# EAGLE design monitoring (EAGLE 7.5.0)
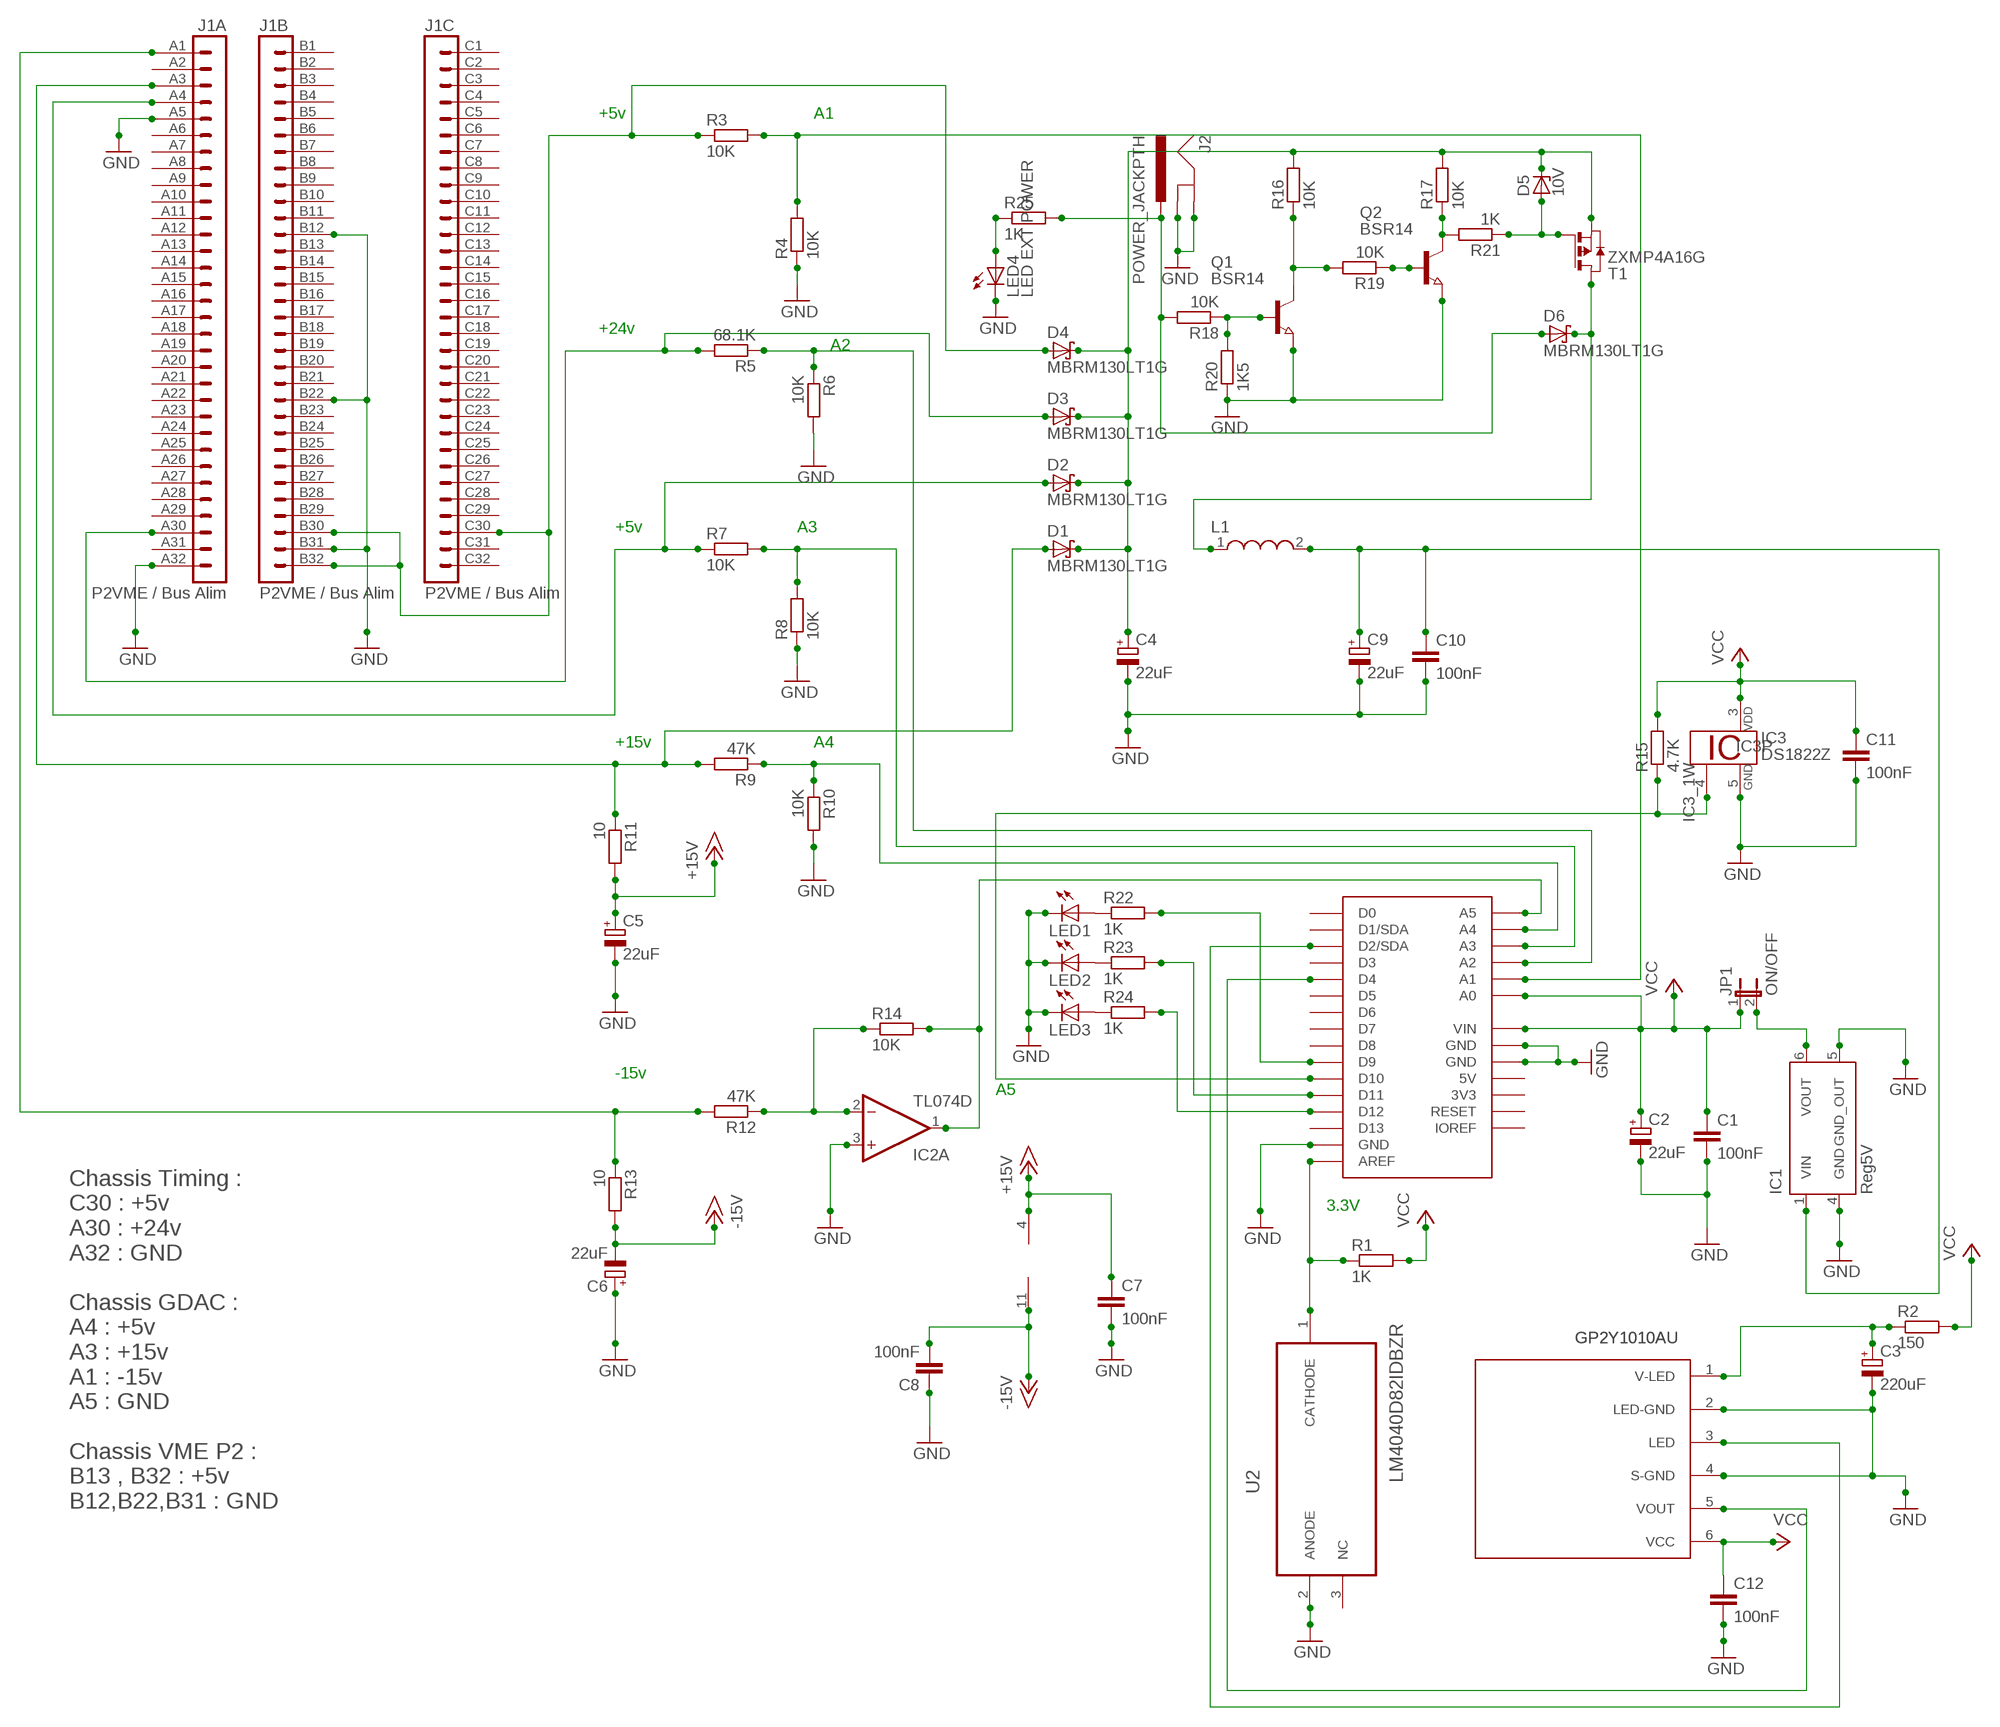
[diagram p0: schematic, sheet 1]

## Parts
C1  100nF  C-EUC1206K  [C1206K]
C2  22uF  CPOL-EUCT7343  [CT7343]
C3  220uF  CPOL-EU150CLZ-0810  [150CLZ-0810]
C4  22uF  CPOL-EUCT7343  [CT7343]
C5  22uF  CPOL-EUCT7343  [CT7343]
C6  22uF  CPOL-EUCT7343  [CT7343]
C7  100nF  C-EUC1206K  [C1206K]
C8  100nF  C-EUC1206K  [C1206K]
C9  22uF  CPOL-EUCT7343  [CT7343]
C10  100nF  C-EUC1206K  [C1206K]
C11  100nF  C-EUC1206K  [C1206K]
C12  100nF  C-EUC1206K  [C1206K]
D1  MBRM130LT1G  SCHOTTKY-DIODE  [DIODE_SMB]
D2  MBRM130LT1G  SCHOTTKY-DIODE  [DIODE_SMB]
D3  MBRM130LT1G  SCHOTTKY-DIODE  [DIODE_SMB]
D4  MBRM130LT1G  SCHOTTKY-DIODE  [DIODE_SMB]
D5  10V  ZENER-DIODESMB  [SMB]
D6  MBRM130LT1G  SCHOTTKY-DIODE  [DIODE_SMB]
IC1  Reg5V  REG5V  [REG5V]
IC2  TL074D  [SO14]
IC3  DS1822Z  [SO08]
J1  P2VME / Bus Alim  VG96-3  [VG96]
J2  POWER_JACKPTH  [POWER_JACK_PTH]
JP1  ON/OFF  JP1E  [JP1]
L1  WE-UKW_1SW_7427501  [WE-UKW_7427501]
LED1  LED_ELD260  [LED_LD260]
LED2  LED_ELD260  [LED_LD260]
LED3  LED_ELD260  [LED_LD260]
LED4  LED EXT POWER  LED_ELD260  [LED_LD260]
Q1  BSR14  NPN-TRANSISTOR_SOT23  [SOT23]
Q2  BSR14  NPN-TRANSISTOR_SOT23  [SOT23]
R1  1K  R-EU_R1206  [R1206]
R2  150  R-EU_R1206  [R1206]
R3  10K  R-EU_R1206  [R1206]
R4  10K  R-EU_R1206  [R1206]
R5  68.1K  R-EU_R1206  [R1206]
R6  10K  R-EU_R1206  [R1206]
R7  10K  R-EU_R1206  [R1206]
R8  10K  R-EU_R1206  [R1206]
R9  47K  R-EU_R1206  [R1206]
R10  10K  R-EU_R1206  [R1206]
R11  10  R-EU_R1206  [R1206]
R12  47K  R-EU_R1206  [R1206]
R13  10  R-EU_R1206  [R1206]
R14  10K  R-EU_R1206  [R1206]
R15  4.7K  R-EU_R1206  [R1206]
R16  10K  R-EU_R1206  [R1206]
R17  10K  R-EU_R1206  [R1206]
R18  10K  R-EU_R1206  [R1206]
R19  10K  R-EU_R1206  [R1206]
R20  1K5  R-EU_R1206  [R1206]
R21  1K  R-EU_R1206  [R1206]
R22  1K  R-EU_R1206  [R1206]
R23  1K  R-EU_R1206  [R1206]
R24  1K  R-EU_R1206  [R1206]
R25  1K  R-EU_R1206  [R1206]
T1  ZXMP4A16G  PMOSSOT223  [SOT223]
U1  YUN_SHIELD-BPLACE  [YUN_SHIELD]
U2  LM4040D82IDBZR  [SOT95P237X112-3N]
U$1  GP2Y1010AU0F  GP2Y1010AU  [GP2Y1010AU]

## Nets
+15V: C5.+ C7.1 IC2.4(P:V+) R11.2
-15V: C6.- C8.2 IC2.11(P:V-) R13.2
GND: C1.2 C2.- C3.- C4.- C5.- C6.+ C7.2 C8.1 C9.- C10.2 C11.2 C12.2 IC1.4(GND) IC1.5(GND_OUT) IC2.3(A:+IN) IC3.5 J1.A5 J1.A32 J1.B12 J1.B22 J1.B31 J2.GND J2.GNDBREAK LED1.K(C) LED2.K(C) LED3.K(C) LED4.K(C) Q1.2(E) Q2.2(E) R4.1 R6.2 R8.1 R10.2 R20.1 U1.GND@1(GND) U1.GND@2(GND) U1.GND@3(GND) U2.2(ANODE) U$1.2(LED-GND) U$1.4(S-GND)
N$1: C3.+ R2.1 U$1.1(V-LED)
N$2: IC1.6(VOUT) JP1.2
N$3: R1.1 U1.AREF U2.1(CATHODE)
N$4: R3.2 R4.2 U1.A1
N$5: R5.1 R6.1 U1.A2
N$6: R7.2 R8.2 U1.A3
N$7: R9.1 R10.1 U1.A4
N$8: Q1.1(B) R18.1 R20.2
N$9: D3.A(C) J1.A30 R5.2
N$10: D2.A(C) J1.A4 R7.1
N$11: D1.A(C) J1.A3 R9.2 R11.1
N$12: C4.+ D1.C(A) D2.C(A) D3.C(A) D4.C(A) D5.C R16.2 R17.2 T1.3(S)
N$13: D4.A(C) J1.B30 J1.B32 J1.C30 R3.1
N$14: IC2.2(A:-IN) R12.1 R14.1
N$15: J1.A1 R12.2 R13.1
N$16: IC2.1(A:OUT) R14.2 U1.A5
N$17: D6.C(A) L1.1 T1.2(D) T1.4(D)
N$18: LED1.A R22.1
N$19: C9.+ C10.1 IC1.1(VIN) L1.2
N$20: Q2.3(C) R17.1 R21.2
N$21: Q2.1(B) R19.1
N$22: Q1.3(C) R16.1 R19.2
N$23: D5.A R21.1 T1.1(G)
N$24: IC3.4 R15.1 U1.D10
N$25: U1.D2(D2/SDA) U$1.3(LED)
N$26: U1.D4 U$1.5(VOUT)
N$27: D6.A(C) J2.PWR R18.2 R25.2
N$28: LED2.A R23.1
N$29: LED3.A R24.1
N$30: R22.2 U1.D9
N$31: LED4.A R25.1
N$32: R23.2 U1.D11
N$33: R24.2 U1.D12
VCC: C1.1 C2.+ C11.1 C12.1 IC3.3 JP1.1 R1.2 R2.2 R15.2 U1.A0 U1.VIN U$1.6(VCC)
Unconnected: IC2.5(B:+IN) IC2.6(B:-IN) IC2.7(B:OUT) IC2.8(C:OUT) IC2.9(C:-IN) IC2.10(C:+IN) IC2.12(D:+IN) IC2.13(D:-IN) IC2.14(D:OUT) J1.A2 J1.A6 J1.A7 J1.A8 J1.A9 J1.A10 J1.A11 J1.A12 J1.A13 J1.A14 J1.A15 J1.A16 J1.A17 J1.A18 J1.A19 J1.A20 J1.A21 J1.A22 J1.A23 J1.A24 J1.A25 J1.A26 J1.A27 J1.A28 J1.A29 J1.A31 J1.B1 J1.B2 J1.B3 J1.B4 J1.B5 J1.B6 J1.B7 J1.B8 J1.B9 J1.B10 J1.B11 J1.B13 J1.B14 J1.B15 J1.B16 J1.B17 J1.B18 J1.B19 J1.B20 J1.B21 J1.B23 J1.B24 J1.B25 J1.B26 J1.B27 J1.B28 J1.B29 J1.C1 J1.C2 J1.C3 J1.C4 J1.C5 J1.C6 J1.C7 J1.C8 J1.C9 J1.C10 J1.C11 J1.C12 J1.C13 J1.C14 J1.C15 J1.C16 J1.C17 J1.C18 J1.C19 J1.C20 J1.C21 J1.C22 J1.C23 J1.C24 J1.C25 J1.C26 J1.C27 J1.C28 J1.C29 J1.C31 J1.C32 U1.D0 U1.D1(D1/SDA) U1.D3 U1.D5 U1.D6 U1.D7 U1.D8 U1.D13 U1.RESET U2.3(NC)

## Notes on the sheet
- +5v | A1
- +24v
- A2
- +5v | A3
- +15v | A4
- -15v
- A5
- 3.3V
- GP2Y1010AU | GP2Y1010AU
- Chassis Timing :
  C30 : +5v 
  A30 : +24v
  A32 : GND
  
  Chassis GDAC :
  A4 : +5v
  A3 : +15v
  A1 : -15v
  A5 : GND
  
  Chassis VME P2 :
  B13 , B32 : +5v
  B12,B22,B31 : GND

## Power pins joined to a net without a drawn wire
3V3: U1.3V3
5V: U1.5V
IOREF: U1.IOREF

## Library data of the parts
C1 C7 C8 C10-C12 = resistor:C-EU: CAPACITOR, European symbol
C2-C6 C9 = resistor:CPOL-EU: POLARIZED CAPACITOR, European symbol
D1-D4 D6 = eagle-ltspice:SCHOTTKY-DIODE: Schottky Diode; SPICEMODEL: NONE; SPICEPREFIX: D; SPICETYPE: diode
D5 = diode:ZENER-DIODE: Z-Diode
IC1 = Reg5v:REG5V: Constant Output SEPIC Converter 5V 1A Source: https://github.com/esaid/Sepic_converter; REG5V: 5V
IC2 = linear:TL074: OP AMP
IC3 = 1wire:DS1822: Econo Digital Thermometer This chip provides a onewire thermosensor with approx. 2°C accuracy. A programmable over/undertemperure alarm is available. Notes: Vdd must be applied for accurate measurements at low temperatures, as the parasite power circuit otherwise heats the sensor. If parasite power is used, Vdd has to be connected to GND. The DS18B20 and DS18S20 are similar chips with approx. 0.5°C accuracy. Author: Jan Kandziora <jjj@gmx.de>
J1 = 19inch:VG96-3: PCB EUROCARD, 96-pin type C/ABC, 2.54 mm
J2 = SparkFun-Connectors:POWER_JACK: Power Jack This is the standard 5.5mm barrel jack for power. The PTH is the most common, proven, reliable, footprint. The Slot footprint only works if the mill layer is transmitted to the PCB fab house so be warned. Mating wall wart : TOL-00298 (and others); PROD_ID: CONN-08197
JP1 = jumper:JP1E: JUMPER
L1 = Eagle_POWER_MAGNETICS_rev16c:WE-UKW_1SW: WE-UKW EMI Suppression 6-Hole Ferrite Bead Characteristics Impedance will increase with more turns, available in 1 to 3 turns 4 different materials available for perfect interference suppression Also available ready-bent or in individual length Maximum current capability is 3 A / 5 A (short-time) Operating temperature: –25 ºC to +125 ºC Applications Protection against radio frequency interferences of components on PCB’s of PC’s, text processing and other digital devices <http://katalog.we-online.de/media/images/eisos/FeUKW_pf2.jpg> Details see: http://katalog.we-online.de/en/pbs/WE-UKW/S/ Created by Dan Xu 2014-06-10 2014 (C) Wurth Elektronik
LED1-LED4 = eagle-ltspice:LED_E: LED Source: http://www.osram.convergy.de Source: www.luxeon.com Source: www.kingbright.com; SPICEMODEL: NONE; SPICEPREFIX: D; SPICETYPE: diode
Q1 Q2 = semicon-smd-ipc:NPN-TRANSISTOR_: NPN TRANSISTOR
R1-R25 = resistor:R-EU_: RESISTOR, European symbol
T1 = zetex:PMOSSOT223: MOS FET; OC_FARNELL: unknown; OC_NEWARK: unknown
U1 = yun_shield:YUN_SHIELD: Arduino YUN mini shield. Originally taken from Adafruit's UNO R3 shield.
U2 = Texas Instruments_By_element14_Batch_1:LM4040D82IDBZR: PRECISION MICROPOWER SHUNT VOLTAGE REFERENCE; MPN: LM4040D82IDBZR; OC_FARNELL: 1576237; OC_NEWARK: 84K2958; PACKAGE: 3-SOT-23; SUPPLIER: TEXAS INSTRUMENTS
U$1 = gp2y1010au:GP2Y1010AU: GP2Y1010AU0F is a dust sensor by optical sensing system. An infrared emitting diode (IRED) and an phototransistor are diagonally arranged into this device. It detects the reflected light of dust in air. Especially, it is effective to detect very fine particle like the cigarette smoke. In addition it can distinguish smoke from house dust by pulse pattern of output voltage. 1. Compact, thin package (46.0 × 30.0 × 17.6 mm) 2. Low consumption current (Icc: MAX. 20 mA) 3. The presence of dust can be detected by the photometry of only one pulse

## Net classes
0 default: width 0.61 mm, clearance 0.205 mm

## Board
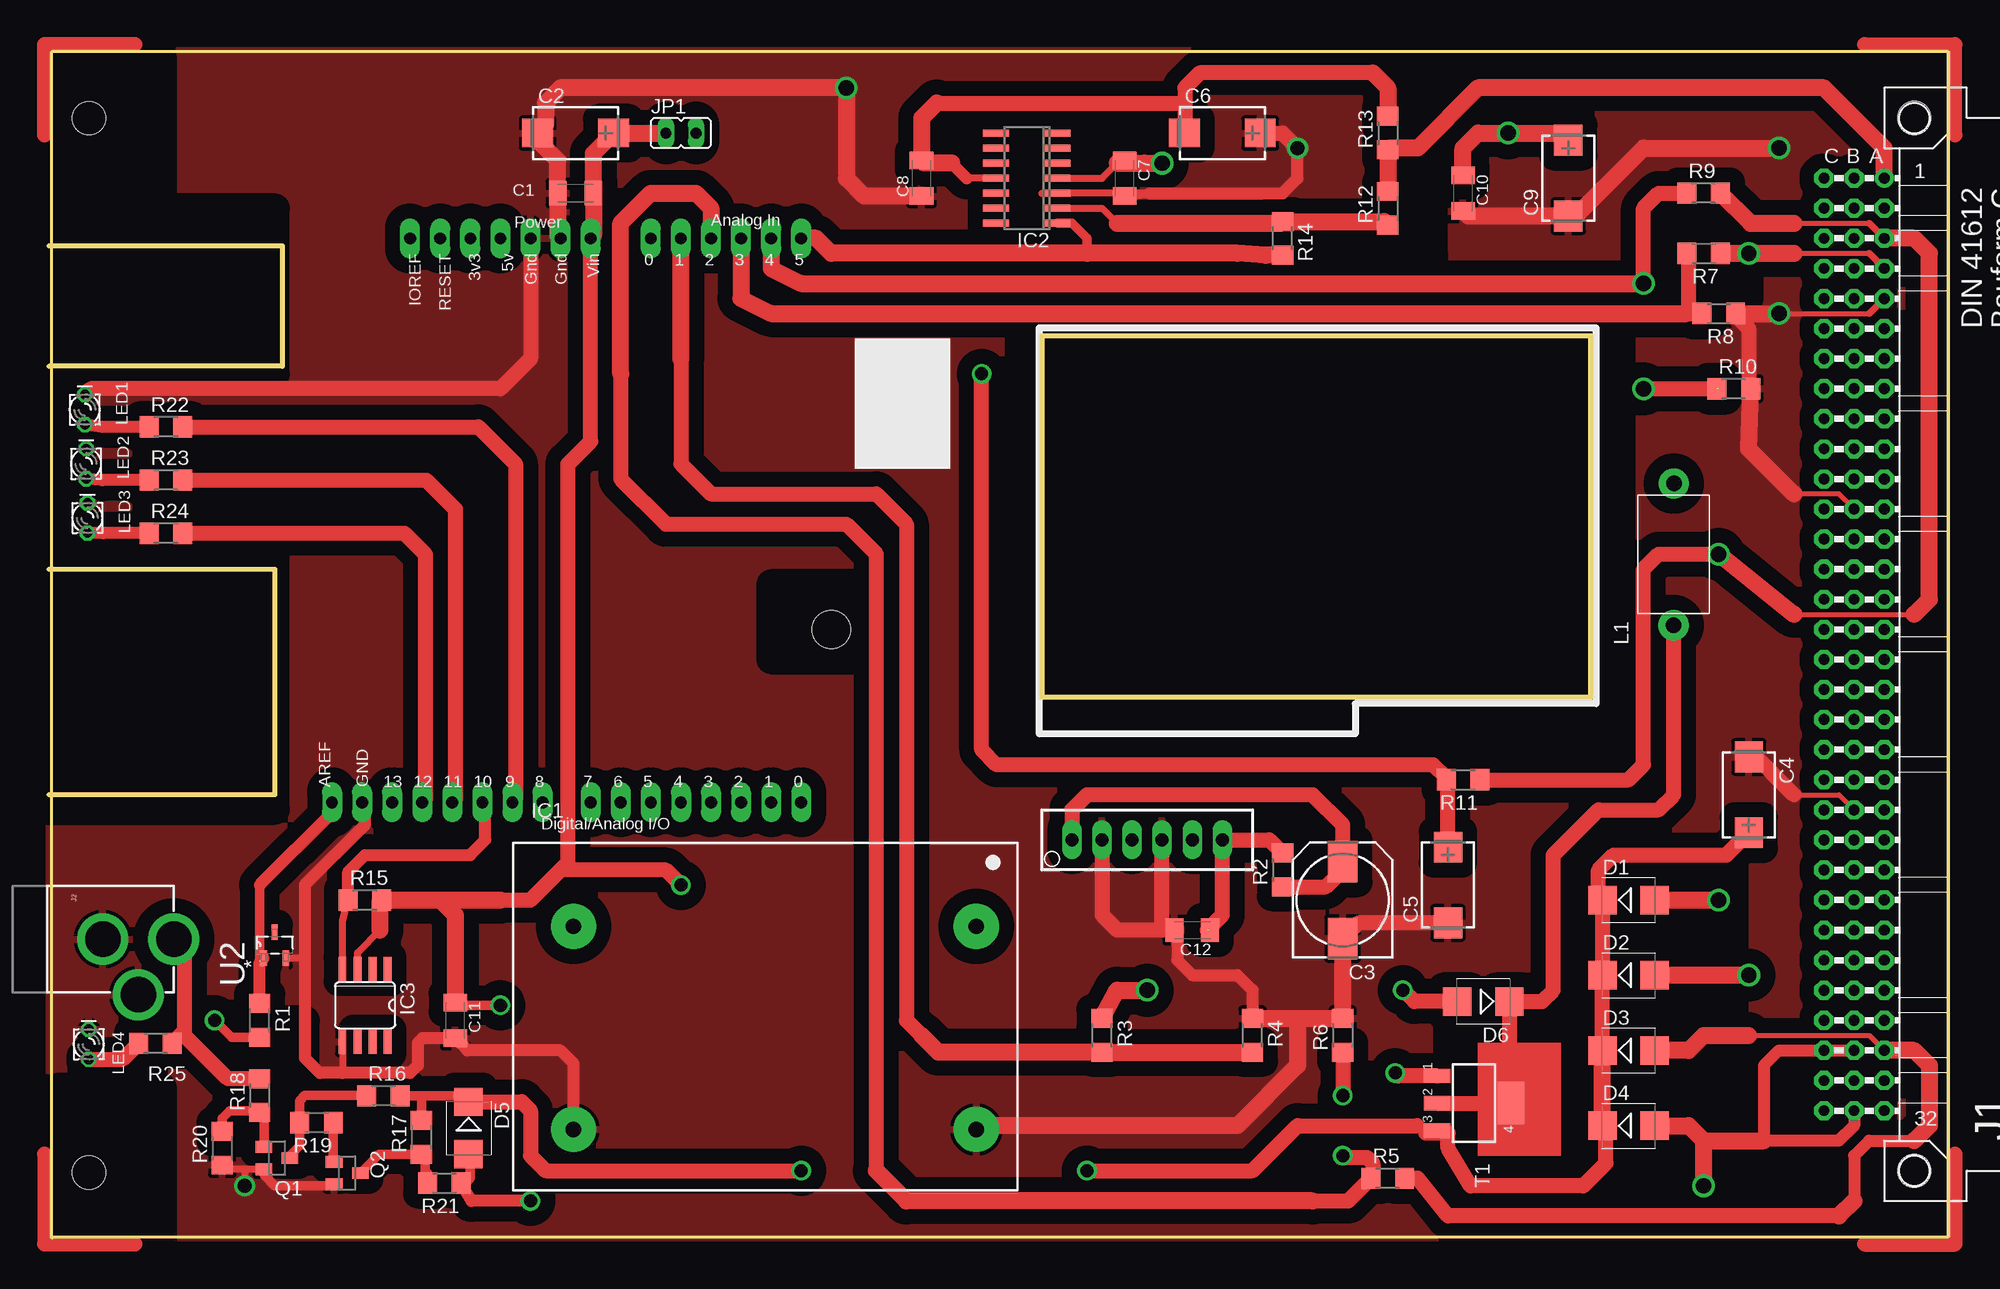
[diagram p1: board, top side]
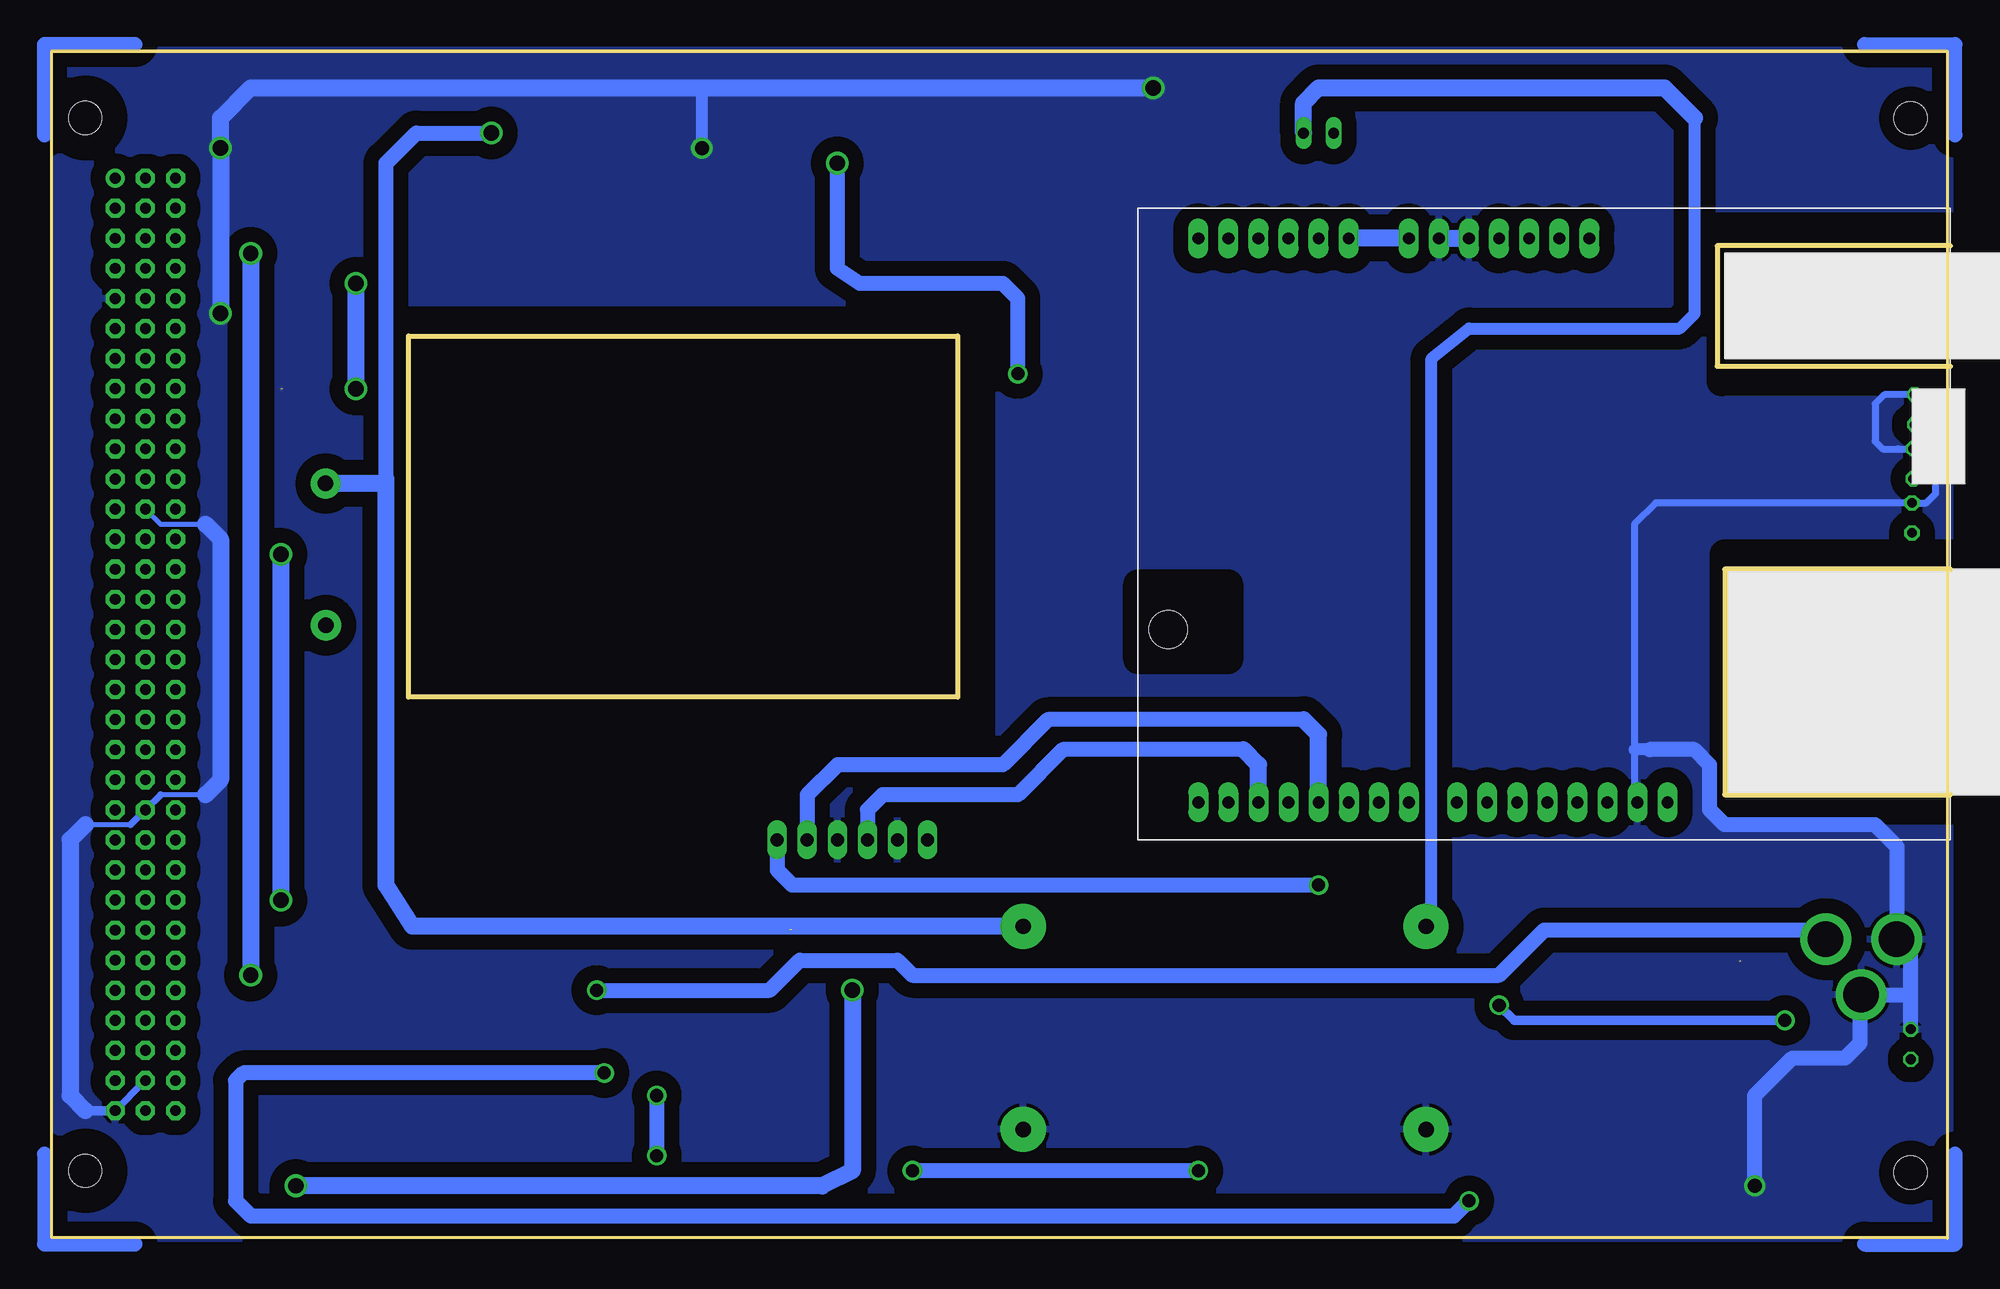
[diagram p2: board, bottom side, seen from below]

Size 160.02 x 100.03 mm. Coordinates in mm from the lower left corner, seen from the top.
Copper layers (1*2+3*4+5*6+7*16): Top 0.035mm / dielectric 0.2mm / Route2 0.035mm / dielectric 0.15mm / Route3 0.035mm / dielectric 0.2mm / Route4 0.035mm / dielectric 0.15mm / Route5 0.035mm / dielectric 0.2mm / Route6 0.035mm / dielectric 0.15mm / Route7 0.035mm / dielectric 0.2mm / Bottom 0.035mm
Design rules "Eagle_WEdirekt_150_check *": minimum track width 6mil, minimum drill 0.25mm, track to track 6mil, track to pad 8mil, pad to pad 8mil, via to via 6mil, smd to smd 8mil, copper to edge 0mil, drill to drill 24mil, minimum pad ring 9mil, minimum via ring 9mil, stop-mask expansion 3mil, vias tented up to drill 0mil, thermal gap 12mil
Holes 2.8 mm at 3.1,94.45 3.1,5.42
tRestrict: area -7.9,72.9 to 18.8,86.8; area -9.1,36 to 18.8,57.6; area 60.7,48.7 to 68.3,55.1; area 117.9,11.9 to 121.7,18.3; area 133.1,13.2 to 142,31; area 105.2,81.8 to 115.3,84.3; area 139.4,79.2 to 143.3,81.8; area 18.8,13.2 to 21.3,18.3; area -0.3,57.6 to 1,72.9; area 112.8,83 to 116.6,89.4; area 81.7,41.1 to 132.5,76.7; area 0.4,-0.2 to 9.3,12.5; area 0.4,86.8 to 9.3,99.5
bRestrict: area -7.9,72.2 to 19.1,85.2; area -9.1,36 to 18.8,57.6; area 60.7,48.7 to 68.3,55.1; area 81.7,41.1 to 130.6,77.3
Milling: 16 lines

### Footprints (pad centres in the part's own frame; a part is rotated, then mirrored left to right if it is on the bottom)
C1206K = smd 1.5 x 2: 1 -1.5,0; 2 1.5,0
CT7343 = smd 2.6 x 2.4: + 3.2,0; - -3.2,0
150CLZ-0810 = smd 3.5 x 2.5: + 3.25,0; - -3.25,0
DIODE_SMB = smd 2.4 x 2.4: A 2.2,0; C -2.2,0
SMB = smd 2.4 x 2.4: A 2.2,0; C -2.2,0
REG5V = drill 1.3 pad 3.81: 1 27.483,6.668; 4 27.483,-10.477; 5 -6.527,-10.477; 6 -6.527,6.668
SO14 = smd 0.6 x 2.2: 1 -3.81,-2.6; 2 -2.54,-2.6; 3 -1.27,-2.6; 4 0,-2.6; 5 1.27,-2.6; 6 2.54,-2.6; 7 3.81,-2.6; 8 3.81,2.6; 9 2.54,2.6; 10 1.27,2.6; 11 0,2.6; 12 -1.27,2.6; 13 -2.54,2.6; 14 -3.81,2.6
SO08 = smd 0.66 x 2.032: 1 -1.905,-3.073; 2 -0.635,-3.073; 3 0.635,-3.073; 4 1.905,-3.073; 5 1.905,3.073; 6 0.635,3.073; 7 -0.635,3.073; 8 -1.905,3.073
VG96 = drill 0.914 pad 1.6: A1 154.94,39.37 | drill 0.914 pad 1.6 octagon: A2 154.94,36.83; A3 154.94,34.29; A4 154.94,31.75; A5 154.94,29.21; A6 154.94,26.67; A7 154.94,24.13; A8 154.94,21.59; A9 154.94,19.05; A10 154.94,16.51; A11 154.94,13.97; A12 154.94,11.43; A13 154.94,8.89; A14 154.94,6.35; A15 154.94,3.81; A16 154.94,1.27; A17 154.94,-1.27; A18 154.94,-3.81; A19 154.94,-6.35; A20 154.94,-8.89; A21 154.94,-11.43; A22 154.94,-13.97; A23 154.94,-16.51; A24 154.94,-19.05; A25 154.94,-21.59; A26 154.94,-24.13; A27 154.94,-26.67; A28 154.94,-29.21; A29 154.94,-31.75; A30 154.94,-34.29; A31 154.94,-36.83; A32 154.94,-39.37; B1 152.4,39.37; B2 152.4,36.83; B3 152.4,34.29; B4 152.4,31.75; B5 152.4,29.21; B6 152.4,26.67; B7 152.4,24.13; B8 152.4,21.59; B9 152.4,19.05; B10 152.4,16.51; B11 152.4,13.97; B12 152.4,11.43; B13 152.4,8.89; B14 152.4,6.35; B15 152.4,3.81; B16 152.4,1.27; B17 152.4,-1.27; B18 152.4,-3.81; B19 152.4,-6.35; B20 152.4,-8.89; B21 152.4,-11.43; B22 152.4,-13.97; B23 152.4,-16.51; B24 152.4,-19.05; B25 152.4,-21.59; B26 152.4,-24.13; B27 152.4,-26.67; B28 152.4,-29.21; B29 152.4,-31.75; B30 152.4,-34.29; B31 152.4,-36.83; B32 152.4,-39.37; C1 149.86,39.37; C2 149.86,36.83; C3 149.86,34.29; C4 149.86,31.75; C5 149.86,29.21; C6 149.86,26.67; C7 149.86,24.13; C8 149.86,21.59; C9 149.86,19.05; C10 149.86,16.51; C11 149.86,13.97; C12 149.86,11.43; C13 149.86,8.89; C14 149.86,6.35; C15 149.86,3.81; C16 149.86,1.27; C17 149.86,-1.27; C18 149.86,-3.81; C19 149.86,-6.35; C20 149.86,-8.89; C21 149.86,-11.43; C22 149.86,-13.97; C23 149.86,-16.51; C24 149.86,-19.05; C25 149.86,-21.59; C26 149.86,-24.13; C27 149.86,-26.67; C28 149.86,-29.21; C29 149.86,-31.75; C30 149.86,-34.29; C31 149.86,-36.83; C32 149.86,-39.37 | hole 2.794: 157.48,44.45; 157.48,-44.45
POWER_JACK_PTH = drill 2.997 pad 4.318: GND 0,7.7; GNDBREAK 4.7,10.7; PWR 0,13.7
JP1 = drill 0.914 long: 1 0,-1.27; 2 0,1.27
WE-UKW_7427501 = drill 0.8: 1 -6,0; 2 6,0
LED_LD260 = drill 0.813 octagon: A -1.27,0; K 1.27,0
SOT23 = smd 1 x 1.4: 1 -0.95,-1.1; 2 0.95,-1.1; 3 0,1.1
R1206 = smd 1.6 x 1.803: 1 -1.422,0; 2 1.422,0
SOT223 = smd 1.219 x 2.235: 1 -2.311,-3.099; 2 0,-3.099; 3 2.311,-3.099 | smd 3.6 x 2.2: 4 0,3.099
YUN_SHIELD = drill 1 pad 1.676 long: 3V3 -43.18,2.54; 5V -45.72,2.54; A0 -58.42,2.54; A1 -60.96,2.54; A2 -63.5,2.54; A3 -66.04,2.54; A4 -68.58,2.54; A5 -71.12,2.54; AREF -31.496,50.165; D0 -71.12,50.165; D1 -68.58,50.165; D2 -66.04,50.165; D3 -63.5,50.165; D4 -60.96,50.165; D5 -58.42,50.165; D6 -55.88,50.165; D7 -53.34,50.165; D8 -49.276,50.165; D9 -46.736,50.165; D10 -44.196,50.165; D11 -41.656,50.165; D12 -39.116,50.165; D13 -36.576,50.165; GND@1 -50.8,2.54; GND@2 -48.26,2.54; GND@3 -34.036,50.165; IOREF -38.1,2.54; RESET -40.64,2.54; VIN -53.34,2.54 | hole 3.2: -73.66,35.56
SOT95P237X112-3N = smd 1.321 x 0.559: 1 -1.092,0.94; 2 -1.092,-0.94 | smd 1.321 x 0.508: 3 1.092,0
GP2Y1010AU = drill 1.1 long: 1 -27.94,5.08; 2 -25.4,5.08; 3 -22.86,5.08; 4 -20.32,5.08; 5 -17.78,5.08; 6 -15.24,5.08

### Placement (x,y rotation side)
C1  44.2,88.11 180 top
C2  44.2,93.19 0 top
C3  108.97,28.42 90 top
C4  143.26,37.31 270 top
C5  117.86,29.69 90 top
C6  98.81,93.19 0 top
C7  90.55,89.38 270 top
C8  73.41,89.38 90 top
C9  128.02,89.38 90 top
C10  119.13,88.11 270 top
C11  34.04,18.26 270 top
C12  96.27,25.88 180 top
D1  133.1,28.42 0 top
D2  133.1,22.07 0 top
D3  133.1,15.72 0 top
D4  133.1,9.37 0 top
D5  35.16,9.18 270 top
D6  120.84,19.85 180 top
IC1  50.55,19.53 0 top
IC2  82.3,89.38 90 top
IC3  26.42,19.53 180 top
J1  -0.25,50.01 0 top
J2  -3.43,25.12 270 top
JP1  53.09,93.19 270 top
L1  136.91,57.63 90 top
LED1  2.76,69.84 90 top
LED2  2.87,65.27 90 top
LED3  2.98,60.69 90 top
LED4  3.09,16.24 90 top
Q1  18.98,6.64 270 top
Q2  24.91,5.37 270 top
R1  17.53,18.26 270 top
R2  103.89,30.96 90 top
R3  88.65,16.99 270 top
R4  101.35,16.99 270 top
R5  112.78,4.93 0 top
R6  108.97,16.99 90 top
R7  139.45,83.03 180 top
R8  140.72,77.95 180 top
R9  139.45,88.11 0 top
R10  141.99,71.6 0 top
R11  119.13,38.58 180 top
R12  112.78,86.84 90 top
R13  112.78,93.19 90 top
R14  103.89,84.3 270 top
R15  26.42,28.42 0 top
R16  27.97,11.89 0 top
R17  31.18,8.38 90 top
R18  17.53,11.91 90 top
R19  22.32,9.65 180 top
R20  14.35,7.47 90 top
R21  33.12,4.52 180 top
R22  9.61,68.38 0 top
R23  9.61,63.89 0 top
R24  9.61,59.4 0 top
R25  8.72,16.32 0 top
T1  120.05,11.27 270 top
U1  -7.87,86.84 180 top
U2  18.8,24.61 90 top
U$1  114.05,28.42 0 top

### Tracks (layer width: path | path; a pad name or v marks a point on that pad's centre or on a via)
+15V  (via drill 1.1, 1.3 pad 1.78)
  Top 0.61: IC2.4 88.65,89.38 89.92,90.65 | 92.23,90.65 C7.1
  Top 1.27: C5.+ 117.86,38.43 R11.2 117.7,38.73 116.59,39.85 79.76,39.85 78.49,41.12 v78.49,72.87
  Top 1.422: 89.92,90.65 92.23,90.65 v93.73,90.65
  Bottom 1.27: v78.49,72.87 78.49,79.22 79.76,80.49 91.82,80.49 93.73,81.76 v93.73,90.65
-15V
  Top 0.61: IC2.11 77.22,89.38 | 73.64,90.65 C8.2
  Top 1.016: 77.22,89.38 75.95,90.65
  Top 1.27: 74.68,95.73 95.63,95.73 | 111.51,98.27 96.9,98.27 95.63,97 95.63,95.73 | 95.63,95.73 95.63,93.22 C6.-
  Top 1.422: 75.95,90.65 73.64,90.65 | 74.68,95.73 73.41,94.46 C8.2 | 111.51,98.27 112.78,97 R13.2
GND  (via drill 1.2, 1.3 pad 1.78)
  Top 0.406: J1.B12 150.88,62.71 147.07,62.71 | J1.B22 150.88,37.31 147.07,37.31 | v145.8,77.95 153.42,77.95
  Top 0.61: C7.2 92.23,88.11 IC2.3 83.57,88.11 | 119.56,86.18 C10.2 | 40.39,93.19 C2.- | 42.7,84.53 U1.GND@1 | 34.27,16.99 C11.2 | 153.42,77.95 J1.A5 | IC3.5 24.51,13.82 | U2.2 21.16,23.52 21.34,23.34 | R20.1 14.71,5.69 Q1.2 16.26,5.69 v16.26,4.29
  Top 0.813: 108.81,18.26 R6.2 | 105,18.41 105.16,18.26 | 41.66,93.85 C2.- | 92.69,88.11 C7.2 | C9.- 128.63,86.18 | Q1.2 17.88,5.21 18.8,4.29 23.69,4.29 Q2.2
  Top 1.016: IC1.5 44.02,14.63 42.93,15.72 35.08,15.72 C11.2 31.27,16.76 30.86,16.36 30.86,14.45 30.23,13.82 24.51,13.82 22.61,13.82 21.34,15.09 21.34,23.34 21.34,29.69 26.42,34.77 26.42,36.42 U1.GND@3 | C12.2 95,25.88 95,23.34 96.27,22.07 100.08,22.07 101.35,20.8 R4.1 | 93.73,32.23 U$1.4 | 92.69,88.11 103.89,88.11 105.16,89.38 v105.16,91.92
  Top 1.27: C5.- 110.29,26.49 C3.- | R8.1 142.14,77.8 143.26,76.68 143.26,71.75 R10.2 | 147.07,37.31 143.26,41.12 | U$1.2 88.65,27.15 89.92,25.88 93.73,25.88 93.73,32.23 | U1.GND@2 40.39,74.14 37.85,71.6 3.26,71.6 LED1.K | C6.+ 103.89,93.19 v105.16,91.92
  Top 1.422: 147.07,62.71 143.26,66.52 R10.2 | C9.- 119.56,86.18 | 40.39,93.19 42.7,90.88 C1.2 42.7,84.53 | C3.- R6.2 R4.1 105,18.41 | 105.16,18.26 105.16,14.45 100.08,9.37 78.35,9.37 IC1.4 | C8.1 68.56,87.88 67.06,89.38 v67.06,97 42.93,97 41.66,95.73 41.66,93.85 | 128.63,86.18 134.37,91.92 v145.8,91.92 | R8.1 v145.8,77.95
  Bottom 0.406: J1.B12 150.88,60.17 147.07,60.17 | 153.42,34.77 157.23,34.77 | 147.07,37.31 150.88,37.31
  Bottom 0.61: J1.A32 J1.B31 | 153.42,34.77 J1.B22 150.88,37.31 | LED2.K 4.13,66.52 1.02,66.52 | 1.02,66.52 1.02,70.33 1.79,71.11 LED1.K 5.32,71.11 6.1,70.33 6.1,67.16 5.46,66.52 4.19,66.52 | 1.02,66.52 1.02,62.71 1.77,61.96 LED3.K 24.62,61.96 26.42,60.17 26.42,41.12 26.42,36.93 U1.GND@3
  Bottom 0.813: 157.23,10.64 J1.A32
  Bottom 1.016: v105.16,91.92 105.16,97 | 25.15,41.12 26.42,41.12 | 4.26,24.96 J2.GND
  Bottom 1.27: 25.15,41.12 21.34,41.12 20.07,39.85 20.07,36.04 18.8,34.77 6.1,34.77 4.26,32.94 4.26,24.96 | LED4.K 3.09,20.17 | 3.09,20.17 3.09,23.94 J2.GND | 3.09,20.17 3.35,20.42 J2.GNDBREAK 7.37,20.33 7.37,16.36 8.64,15.09 13.08,15.09 16.26,11.91 v16.26,4.29
  Bottom 1.422: U1.GND@1 U1.GND@2 | 147.07,60.17 145.8,58.9 145.8,38.58 147.07,37.31 | 157.23,34.77 158.5,33.5 158.5,11.91 157.23,10.64 | v67.06,97 105.16,97 143.26,97 145.8,94.46 v145.8,91.92 v145.8,77.95
  pour Bottom (isolate 1.27): -0.25,100.18 159.77,100.18 159.77,-0.15 -0.25,-0.15
  pour Top (isolate 1.27): -0.25,100.18 160.4,100.18 160.4,-0.15 -0.25,-0.15
N$1
  Top 1.27: R2.1 107.54,29.54 108.97,30.96 C3.+ 108.97,34.77 106.43,37.31 87.38,37.31 86.11,36.04 U$1.1
N$2
  Bottom 1.016: IC1.6 43.88,26.2 43.56,27.15 43.56,74.14 40.39,76.68 22.61,76.68 21.34,77.95 21.34,94.46
  Bottom 1.422: JP1.2 54.36,95.73 53.09,97 23.88,97 21.34,94.46
N$3  (1 unrouted)
  Top 0.813: 17.53,29.69 17.53,23.34
  Top 1.016: R1.1 17.53,23.19 U2.1 | U1.AREF 23.62,35.79 17.53,29.69
N$4
  Top 1.27: 53.09,74.14 53.09,65.25 55.63,62.71 69.6,62.71 72.14,60.17 72.14,18.26 74.04,16.36
  Top 1.422: R4.2 R3.2 74.83,15.57 74.04,16.36 73.41,16.99 | 53.09,74.14 U1.A1
N$5  (via drill 1.1)
  Top 1.27: v108.97,6.83 108.81,6.68 111.02,6.68 111.51,6.2 111.51,5.08 R5.1 109.45,3.02 106.43,3.02 | R6.1 v108.97,11.91 | 69.6,5.56 69.6,57.63 67.06,60.17 51.82,60.17 48.01,63.98 48.01,72.87
  Top 1.422: 106.43,3.02 72.14,3.02 69.6,5.56 | 48.01,72.87 48.01,85.57 50.55,88.11 54.36,88.11 55.63,86.84 U1.A2
  Bottom 1.27: v108.97,11.91 v108.97,6.83
N$6
  Top 1.27: 138.02,77.95 138.18,77.95 | 138.18,77.95 138.18,82.88 R7.2 | 138.18,77.95 R8.2
  Top 1.422: U1.A3 58.17,79.22 60.71,77.95 138.02,77.95
N$7  (via drill 1.3 pad 1.78)  (1 unrouted)
  Top 1.27: v134.37,80.49 134.37,86.84 135.64,88.11 R9.1 | v134.37,71.6 140.72,71.6
  Top 1.422: U1.A4 60.71,81.76 63.25,80.49 v134.37,80.49
  Bottom 1.422: v134.37,71.6 v134.37,80.49
N$8
  Top 0.813: R20.2 14.35,10.01 14.99,10.64 17.37,10.64 R18.1 17.88,10.13 Q1.1
N$9
  Top 0.406: J1.A30 153.42,16.99 143.26,16.99
  Top 1.016: 157.23,8.1 153.42,8.1 152.15,6.83 152.15,3.02
  Top 1.27: 150.88,1.75 117.86,1.75 115.32,4.93 R5.2
  Top 1.422: D3.A 138.18,15.72 139.45,16.99 143.26,16.99 | J1.A30 157.23,15.72 158.5,14.45 158.5,9.37 157.23,8.1 | 152.15,3.02 150.88,1.75
N$10  (via drill 1.3 pad 1.78)
  Top 0.406: 147.07,83.03 153.42,83.03
  Top 0.61: J1.A4 153.42,83.03
  Top 1.422: R7.1 v143.26,83.03 147.07,83.03 | v143.26,22.07 D2.A
  Bottom 1.422: v143.26,83.03 v143.26,22.07
N$11  (via drill 1.3 pad 1.78)
  Top 0.406: 147.07,85.57 153.42,85.57 | 147.07,52.55 157.23,52.55
  Top 0.61: J1.A3 153.42,85.57
  Top 1.27: R11.1 133.1,38.58 134.37,39.85 134.37,56.36 135.64,57.63 v140.72,57.63
  Top 1.422: R9.2 143.41,85.57 147.07,85.57 | 157.23,52.55 158.5,53.82 158.5,83.03 157.23,84.3 J1.A3 | D1.A v140.72,28.42 | v140.72,57.63 147.07,52.55
  Bottom 1.422: v140.72,57.63 v140.72,28.42
N$12  (via drill 1.1)
  Top 0.61: 115.26,9.37 T1.3
  Top 0.813: R16.2 31.5,11.89 | 31.5,11.89 35.92,11.89 D5.C | R17.2 31.18,11.57 31.5,11.89 | 115.26,9.37 115.32,9.37 115.95,8.74
  Top 1.27: D5.C 39.64,11.38 40.39,10.64 40.39,6.83 41.66,5.56 v63.25,5.56 | v87.38,5.56 101.35,5.56 105.16,9.37 115.26,9.37 | D3.C D2.C D1.C 130.56,28.76 130.56,30.96 131.83,32.23 141.38,32.23 C4.+ | 115.95,8.74 117.86,8.74 117.86,7.47 119.76,4.29 129.29,4.29 131.19,6.2 131.19,9.08 D4.C
  Top 1.422: D4.C D3.C
  Bottom 1.27: v63.25,5.56 v87.38,5.56
N$13  (via drill 1.3 pad 1.78)
  Top 1.016: J1.B32 152.15,9.37 150.88,8.1 144.53,8.1 144.53,14.45 145.8,15.72 J1.C30 J1.B30
  Top 1.422: R3.1 89.92,20.8 v92.46,20.8 | D4.A 138.18,9.37 139.45,8.1 | 139.45,8.1 144.53,8.1 | v139.45,4.29 139.45,8.1
  Bottom 1.422: v92.46,20.8 92.46,5.56 95,4.29 v139.45,4.29
N$14
  Top 0.61: IC2.2 88.65,86.84 89.92,85.57 | 103.73,85.57 R14.1
  Top 0.813: 112.47,85.72 R12.1
  Top 1.422: R14.1 112.47,85.72 | 89.92,85.57 103.73,85.57
N$15
  Top 0.813: 112.93,91.92 R13.1
  Top 1.422: J1.A1 154.69,91.92 149.61,97 120.4,97 115.32,91.92 112.93,91.92 | R13.1 R12.2
N$16
  Top 0.813: IC2.1 86.11,85.57 87.38,84.3 87.38,83.03
  Top 1.422: U1.A5 64.52,84.3 65.79,83.03 87.38,83.03 100.08,83.03 102.46,82.88 R14.2
N$17  (via drill 1.3 pad 2.54)
  Top 1.27: T1.2 T1.4 123.04,11.37 D6.C 125.79,19.85 126.75,20.8 126.75,32.23 130.56,36.04 135.64,36.04 136.91,37.31 L1.1
  other vias: 136.91,51.63
N$18
  Top 1.016: R22.1 4.22,68.38 LED1.A
N$19  (via drill 1.3 pad 1.78)
  Top 0.813: 127.41,93.19 C9.+
  Top 1.422: C10.1 119.13,91.92 120.4,93.19 v122.94,93.19 127.41,93.19
  Bottom 1.27: 131.83,63.98 131.83,90.65 129.29,93.19 v122.94,93.19
  Bottom 1.422: IC1.1 129.6,26.2 131.83,29.69 131.83,63.98 132.18,63.63 L1.2
N$20
  Top 0.813: Q2.3 27.61,6.96 R17.1 31.5,6.64 31.5,5.56 31.7,5.36 R21.2
N$21
  Top 0.813: R19.1 23.75,6.38 Q2.1
N$22
  Top 0.813: R16.1 26.53,11.91 21.34,11.91 20.9,11.48 R19.2 20.9,7.67 20.08,6.85 Q1.3
N$23  (via drill 1.1)
  Top 0.813: R21.1 34.9,4.52 35.31,4.93 35.31,6.84 D5.A
  Top 1.016: v40.39,3.02 35.41,3.02 R21.1
  Top 1.27: T1.1 113.65,13.58 v113.41,13.82
  Bottom 1.27: v113.41,13.82 143.89,13.82 144.53,13.18 144.53,3.02 143.26,1.75 41.66,1.75 v40.39,3.02
N$24
  Top 0.61: IC3.4 24.51,26.67 R15.1
  Top 0.813: 36.58,36.42 U1.D10
  Top 1.016: R15.1 24.99,30.81 26.42,32.23 35.31,32.23 36.58,33.5 36.58,36.42
N$25
  Bottom 1.27: 59.44,41.12 74.68,41.12 78.49,37.31 89.92,37.31 91.19,36.04 U$1.3
  Bottom 1.422: U1.D2 58.17,39.85 59.44,41.12
N$26
  Bottom 1.27: 54.36,43.66 75.95,43.66 79.76,39.85 93.73,39.85 96.27,37.31 U$1.5
  Bottom 1.422: U1.D4 53.09,42.39 54.36,43.66
N$27  (via drill 1.1)
  Top 1.27: D6.A 115,19.85 v114.05,20.8 | 11,17.17 11.18,17.35 11.18,24.39 11,24.39 J2.PWR | 11,17.17 R25.2 | R18.2 14.83,13.33 11,17.17
  Bottom 1.27: v114.05,20.8 99.44,20.8 96.9,23.34 88.65,23.34 87.38,22.07 37.85,22.07 34.04,25.88 11.03,25.88 J2.PWR
N$28
  Top 1.016: R23.1 4.25,63.89 LED2.A
N$29
  Top 1.016: R24.1 4.28,59.4 LED3.A
N$30
  Top 1.27: R22.2 35.99,68.38 39.12,65.25 39.12,36.93 U1.D9
N$31
  Top 1.27: LED4.A 5.95,14.97 R25.1
N$32
  Top 1.27: R23.2 31.59,63.89 34.04,61.44 34.04,36.93 U1.D11
N$33
  Top 1.016: R24.2
  Top 1.27: R24.2 29.73,59.4 31.5,57.63 31.5,36.93 U1.D12
N$34  (via drill 1.3 pad 2.54)
  other vias: 136.94,63.6
VCC  (via drill 1.1)  (1 unrouted)
  Top 0.61: 45.7,84.53 U1.VIN | IC3.3 25.78,23.98 27.69,25.88 | 27.69,28.27 R15.2
  Top 0.813: C11.1 34.27,19.53 v37.85,19.53 | R1.2 15.14,16.84 v13.72,18.26
  Top 1.27: 37.85,28.42 40.39,28.42 42.93,30.96 | 42.93,30.96 43.56,31.6 43.56,65.25 45.47,67.16 U1.VIN | v53.09,29.69 51.82,30.96 42.93,30.96 | R2.2 102.77,33.5 U$1.6 98.81,27.15 97.54,25.88
  Top 1.422: JP1.1 C2.+ 45.7,91.49 C1.1 45.7,84.53 | 27.69,25.88 27.69,28.27 | R15.2 32.77,28.42 | 32.77,28.42 34.04,27.15 C11.1 | 32.77,28.42 37.85,28.42
  Bottom 0.813: v13.72,18.26 36.58,18.26 v37.85,19.53
  Bottom 1.27: U$1.6 98.81,30.96 97.54,29.69 v53.09,29.69
  Bottom 1.422: U1.VIN U1.A0
(copper drawn outside any net)
  shapes: Top area x1